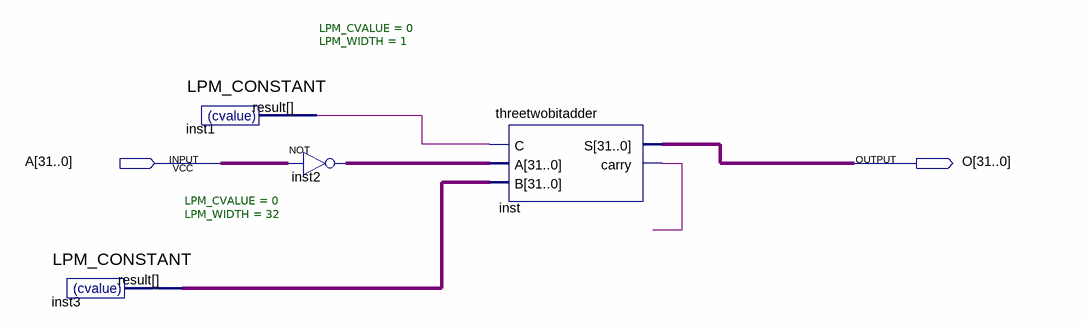
[diagram p0: schematic sheet]
// Quartus schematic invertor.bdf as structural Verilog: 4 symbols, 2 pins
module invertor (
  input  [31:0] A,
  output [31:0] O
);

  wire inst1_result, inst_carry;
  wire [31:0] inst2_out, inst3_result;

  LPM_CONSTANT #(.LPM_CVALUE(0), .LPM_WIDTH(32)) inst3 (.result(inst3_result));
  LPM_CONSTANT #(.LPM_CVALUE(0), .LPM_WIDTH(1)) inst1 (.result(inst1_result));
  assign inst2_out = ~A;  // NOT inst2, 32 bits wide
  threetwobitadder inst (.C(inst1_result), .A(inst2_out), .B(inst3_result), .S(O), .carry(inst_carry));
endmodule
